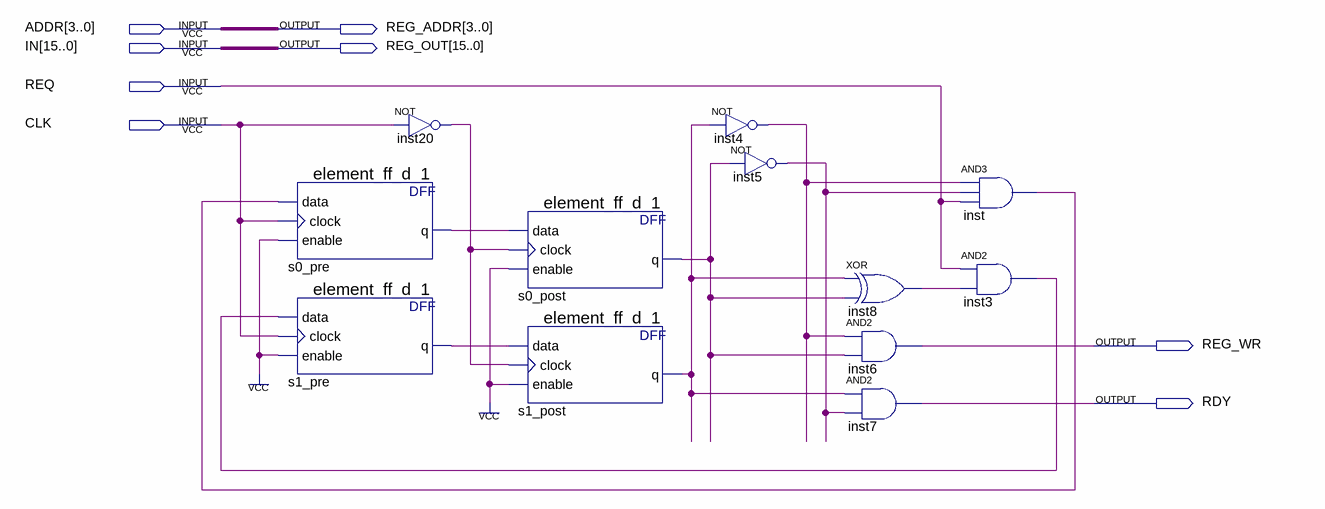
[diagram p0: schematic sheet]
// Quartus schematic block-writer-variant-write-to-reg.bdf as structural Verilog: 12 symbols, 8 pins
module \block-writer-variant-write-to-reg  (
  input  [3:0] ADDR,
  input  [15:0] IN,
  input  REQ,
  input  CLK,
  output [3:0] REG_ADDR,
  output [15:0] REG_OUT,
  output REG_WR,
  output RDY
);

  wire inst3_out, inst4_out, inst5_out, inst8_out, inst20_out, inst_out, s0_post_q, s0_pre_q, s1_post_q,
       s1_pre_q;

  element_ff_d_1 s0_pre (.data(inst_out), .clock(CLK), .enable(1'b1), .q(s0_pre_q));
  element_ff_d_1 s1_pre (.data(inst3_out), .clock(CLK), .enable(1'b1), .q(s1_pre_q));
  not inst20 (inst20_out, CLK);
  element_ff_d_1 s0_post (.data(s0_pre_q), .clock(inst20_out), .enable(1'b1), .q(s0_post_q));
  element_ff_d_1 s1_post (.data(s1_pre_q), .clock(inst20_out), .enable(1'b1), .q(s1_post_q));
  not inst4 (inst4_out, s1_post_q);
  not inst5 (inst5_out, s0_post_q);
  xor inst8 (inst8_out, s1_post_q, s0_post_q);
  and inst6 (REG_WR, inst4_out, s0_post_q);
  and inst7 (RDY, s1_post_q, inst5_out);
  and inst (inst_out, inst4_out, inst5_out, REQ);
  and inst3 (inst3_out, REQ, inst8_out);

  assign REG_ADDR = ADDR;
  assign REG_OUT = IN;
endmodule
